# Altium project Off-Line 3W Non Isolated Power Supply.PrjPcb
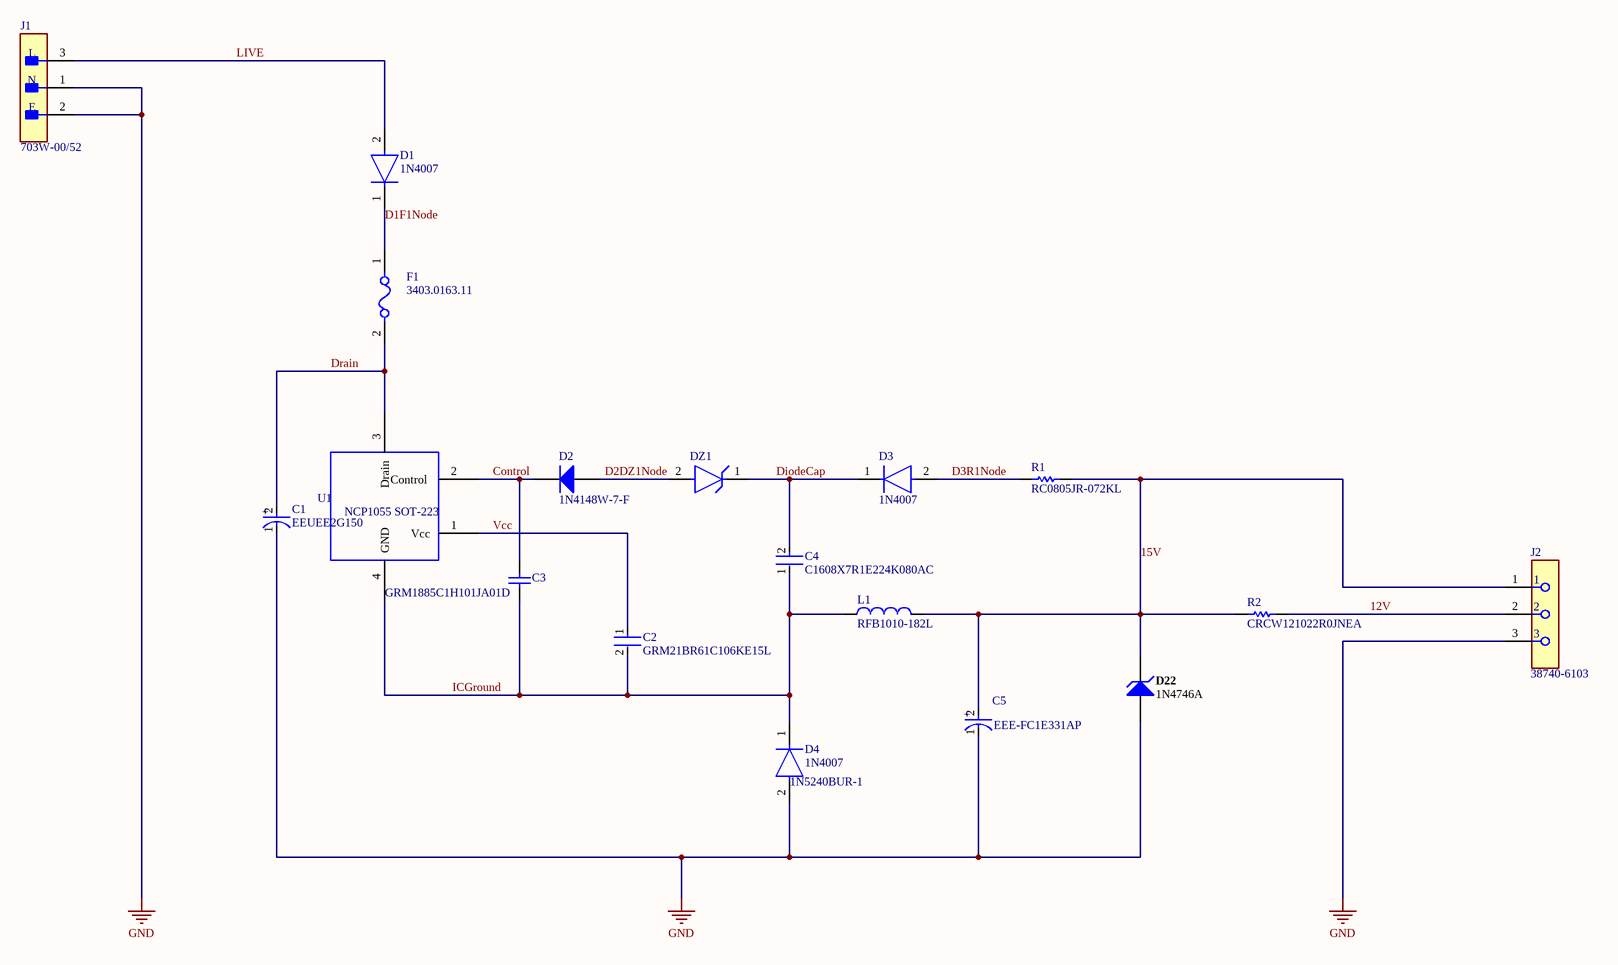
[diagram p0: Off-Line 3W Non Isolated Power Supply.SchDoc]
1 sheet, 18 parts. Net scope: global (net labels, ports and power ports of the same name join across sheets).
Board file: Off-Line 3W Non Isolated Power Supply.PcbDoc

## Sheet Off-Line 3W Non Isolated Power Supply.SchDoc
size A3; SheetNumber: 1; SheetTotal: 1

### Parts
C1  EEUEE2G150  [FP-RAD-TH-D_12_5_0_5-L_20-MFG]
C2  GRM21BR61C106KE15L  [FP-GRM21B-0_1-IPC_C]
C3  GRM1885C1H101JA01D  [CAPC1608X90X35NL10T15]
C4  C1608X7R1E224K080AC  [FP-C1608-080-0_1-IPC_B]
C5  EEE-FC1E331AP  [FP-FC-G-MFG]
D1  1N4007  [FP-1N4007-MFG]
D2  1N4148W-7-F  [DIOD-SOD123-2_V]
D3  1N4007  [FP-1N4007-MFG]
D4  1N4007  [FP-1N4007-MFG]
D22  1N4746A  [FAIR-DO-41-2_V]
DZ1  1N5240BUR-1  [FP-DO-213AA-MFG]
F1  3403.0163.11  [FP-3403_0163_11-MFG]
J1  703W-00/52  [FP-703W-00-52-MFG]
J2  38740-6103  [FP-38740-6103-MFG]
L1  RFB1010-182L  [COIL-RFB1010-2_V]
R1  RC0805JR-072KL  [RESC2013X60X35ML10T20]
R2  CRCW121022R0JNEA  [RESC3225X60X45ML20T20]
U1  NCP1055 SOT-223  [NCP1055 SOT-223]

### Nets
GND: C1.1(C) C5.1(C) D4.2(A) D22.1(A) J1.1(N) J1.2(E) J2.3
12V: J2.2 R2.2
15V: C5.2(A) D22.2(K) J2.1 L1.2 R1.2 R2.1
Control: C3.2 D2.2(K) U1.2(Control)
D1F1Node: D1.1(C) F1.1
D2DZ1Node: D2.1(A) DZ1.2(A)
D3R1Node: D3.2(A) R1.1
DiodeCap: C4.2 D3.1(C) DZ1.1(C)
Drain: C1.2(A) F1.2 U1.3(Drain)
ICGround: C2.2 C3.1 C4.1 D4.1(C) L1.1 U1.4(GND)
LIVE: D1.2(A) J1.3(L)
Vcc: C2.1 U1.1(Vcc)

### Notes on the sheet
- (in symbol CMP-05427-000018-1) +
- (in symbol CMP-05427-000533-1) +

### Library data of the parts
C1 = CMP-05427-000533-1: Aluminum Electrolytic Capacitors (Radial Lead Type) 15uF ±20% 400V; Leakage Current: 370uA; Life (Hours): 10000Hour; Ripple Current: 590mA; Dielectric Material: Aluminium; Polarity: Polar; Lead Diameter: 0.6mm; Dissipation Factor: 0.24%; Construction: RADIAL; Package Quantity: 200; Min Operating Temperature: -25°C; Case/Package: Radial; Voltage: 400V; Tolerance: 20%; Voltage Rating: 400V; Mount: Through Hole; REACH SVHC: No SVHC; Height: 20mm; Capacitance: 15uF; Series: EE; Length: 20mm; Packaging: Bulk; Height - Seated (Max): 0.866inch; Ripple Current (AC): 590mA; Number of Pins: 2; Voltage Rating (DC): 400V; Radiation Hardening: No; Lead Free: Lead Free; Max Operating Temperature: 105°C; RoHS Compliant: Yes; Diameter: 12.5mm; Termination: Radial; Lead Pitch: 5mm
C2 = CMP-2007-03453-2: Chip Multilayer Ceramic Capacitors for General Purpose, 0805, 10uF, X5R, 15%, 10%, 16V; Radiation Hardening: No; Thickness: 0.053inch; Voltage Rating (DC): 16V; Lead Free: Lead Free; Package Quantity: 1; Width: 1.25mm; Case Code (Imperial): 0805; Depth: 1.25mm; Packaging: Tape and Reel; Dielectric: X5R; Max Operating Temperature: 85°C; Tolerance: 10%; Voltage Rating: 16V; Voltage: 16V; Capacitance: 10uF; Height: 1.25mm; Case Code (Metric): 2012; Material: Ceramic; Mount: Surface Mount; Case/Package: 0805; REACH SVHC: No SVHC; Length: 2mm; Min Operating Temperature: -55°C; Termination: SMD/SMT
C3 = CMP-2006-02595-1: Manufacturer: Murata; Part Number: GRM1885C1H101JA01D
C4 = CMP-08246-006302-1: Multilayer Ceramic Capacitors 220nF ±10% 25V X7R SMD 0603; Lead Free: Lead Free; Radiation Hardening: No; Min Operating Temperature: -55°C; RoHS Compliant: Yes; Series: C; Depth: 0.8mm; Capacitance: 220nF; Case/Package: 0603; Max Operating Temperature: 125°C; Dielectric Material: Ceramic; Construction: Flat; REACH SVHC: No SVHC; Packaging: Tape and Reel; Voltage Rating: 25V; Thickness: 0.037inch; Width: 0.031inch; Number of Pins: 2; Package Quantity: 1; Weight: 7.1E-05oz; Mount: Surface Mount; Length: 1.6mm; Case Code (Imperial): 0603; Resistor Type: Ceramic; Voltage Rating (DC): 25V; Height: 0.8mm; Termination: SMD/SMT; Dielectric: X7R; Case Code (Metric): 1608; Tolerance: 10%
C5 = CMP-05427-000018-1: CAP ALUM 330UF 20% 25V SMD; Leakage Current: 3uA; Ripple Current (AC): 670mA; Impedance: 150mR; Life (Hours): 1000Hour; Lead Length: 3.5mm; Dielectric Material: Aluminium; Packaging: Tape and Reel; Diameter: 10mm; Contact Plating: Tin; Voltage Rating: 25V; Voltage Rating (DC): 25V; Width: 10.3mm; Case/Package: Radial; Lead Pitch: 4.6mm; Termination: SMD/SMT; Min Operating Temperature: -40°C; Radiation Hardening: No; Height - Seated (Max): 0.402inch; Mount: Surface Mount; Ripple Current: 670mA; Tolerance: 20%; Max Operating Temperature: 105°C; ESR (Equivalent Series Resistance): 150mR; Number of Pins: 2; Length: 10.5mm; REACH SVHC: No SVHC; Voltage: 25V; Height: 10.2mm; Lead Free: Lead Free; Capacitance: 330uF; Package Quantity: 1
D1 D3 D4 = CMP-123542-000001-1: Rectifier diode 1000 V 1 A DO-41, ,; Manufacturer: Diotec; Max Surge Forward Current: 27A; Forward Current: 1A; Max Junction Temp: +175°C; Reverse Voltage: 1000V; Value: 15pF; Peak Reverse Current: 5uA; Category: Diode; Temperature Range Low: -50°C; Automotive: No; Temperature: -50°C to +175°C; Lead Free: Yes; ComponentLink2Description: Datasheet; Max Repetitive Reverse Voltage: 1000V; ComponentLink2URL: https://datasheet.octopart.com/1N4007-Diotec-datasheet-62346875.pdf; Manufacturer Part Number: 1N4007; Device Class L3: Rectifier Diodes; Height: 2.8mm; Octopart: https://octopart.com/1n4007-diotec-4040411; Package: 1N4007; Temperature Range High: +175°C; Device Class L1: Discrete Semiconductors; Device Class L2: Diodes; RoHS: TRUE; Capacitance: 15pF; Ipc Land Pattern Name: DIOAD888W100L520D280
D2 = CMP-2000-04932-2: Fast Switching Diode, 100 V, 0.15 A, -65 to 150 degC, 2-Pin?SOD123, RoHS, Tape and Reel; Recovery Time: 4ns; Brand: DiodesIncorporated; Unit Weight: 0.000353oz; Max Surge Current: 2A; Peak Reverse Voltage: 100V; Ir - Reverse Current: 1uA; Vf - Forward Voltage: 1.25V; Configuration: Single; If - Forward Current: 0.15A; Product Category: Diodes-GeneralPurpose,Power,Switching; Operating Temperature Range: -65Cto+150C; Packaging: Reel; Manufacturer URL: http://www.diodes.com/; Maximum Operating Temperature: +150C; Height: 1.25mm; Minimum Operating Temperature: -65C; Product: SwitchingDiodes; Package URL: http://www.diodes.com/datasheets/ds18004.pdf; Type: SwitchingDiode; Package Reference: SOD123-2; Width: 1.7mm; Datasheet URL: http://www.farnell.com/datasheets/1915529.pdf; Datasheet Version: Rev. 24-2, 10/2013; Series: 1N4148; Factory Pack Quantity: 3000; Length: 2.85mm; RoHS: True; Manufacturer: DiodesIncorporated; Mounting Style: SMD/SMT; Package / Case: SOD-123
D22 = CMP-0892-00023-1: Zener Diode, 18V, 1W, 5%, -65 to 200 degC, 2-Pin DO-41, Body 2.72 x 5.2 mm, RoHS; Manufacturer: Fairchild Semiconductor; VZ (Max.) (V): 18.9; IR (uA): 5; Test Current IZ (mA): 14; VZ (Min.) (V): 17.1; ZZ (Max) (ohm): 16; PD (W): 1; Operating and Storage Temperature Range: -65 to 200 degC; RoHS: TRUE; ComponentLink1URL: http://www.fairchildsemi.com/; DatasheetVersion: Rev. H3; ComponentLink2Description: Datasheet; ComponentLink3Description: Package Specification; Tolerance: 5%; ComponentLink3URL: http://www.fairchildsemi.com/dwg/DO/DO41A.pdf; PackageVersion: Rev. 2; PartNumber: 1N4746A; ComponentLink2URL: http://www.fairchildsemi.com/ds/1N/1N4744A.pdf; Mounting Technology: Through Hole; PackageDescription: 2-Pin Axial leaded, Body 2.72 x 5.2 mm, Lead Spread 25.4 mm; PackageReference: DO-41-2; ComponentLink1Description: Manufacturer URL
DZ1 = CMP-06360-000046-1: DIODE ZENER
F1 = CMP-26293-000009-1: FUSE BRD MNT 500MA 250VAC 125VDC; Manufacturer: Schurter Inc; Fuse Blow Speed: Slow; Fuse Current: 0.5A; Description: 500mA 250V AC 125V DC Fuse Board Mount (Cartridge Style Excluded) Surface Mount 2-SMD, Square End Block; Max Fuse Ac Voltage: 250V; Fuse I2T: 0.54A2Sec; Fuse Voltage Drop: 600mV; Max Fuse Dc Voltage: 125V; Ambient Temperature Range High: +125°C; Category: Fuse; Lead Free: Yes; Digikey Description: FUSE BRD MNT 500MA 250VAC 125VDC; Height: 3mm; Ambient Temperature Range Low: -55°C; Device Class L1: Circuit Protection; Octopart: https://octopart.com/3403.0163.11-schurter-65395; ComponentLink2URL: https://us.schurter.com/bundles/snceschurter/epim/_ProdPool_/newDS/en/typ_UMT_250.pdf; Device Class L3: unset; Automotive: No; ComponentLink2Description: Datasheet; Device Class L2: Fuses; Package: 0; RoHS: TRUE; Voltage Rating: 125V; Mouser Description: Surface Mount Fuses UMT 250 500mA 277V Slow; Manufacturer Part Number: 3403.0163.11
J1 = CMP-64678-000001-1: PWR ENT RCPT IEC320-C14 PNL SLDR; Max Voltage Rating (AC): 250V; Approvals: UL; Current Rating: 15A; Number of Poles: 2; Fuse: No; Number of Positions: 3; Gender: Receptacle; Panel Thickness: 0.12inch; Pitch: 7mm; Voltage Rating (AC): 250V; Orientation: Right Angle; Contact Plating: Tin; Mount: Through Hole; Housing Material: Thermoplastic; Current: 15A; Termination: Solder; REACH SVHC: No SVHC; Lead Free: Lead Free; Voltage Rating: 250V; Number of Contacts: 3; Color: Black; Connector Type: Receptacle; Packaging: Bulk; Max Current Rating: 15A; Voltage Rating (DC): 250V; Package Quantity: 100
J2 = CMP-00257-08326119-1: 38740-6103 11.11mm Pitch Beau PCB Fixed Mount Barrier Terminal Strip, Low Profile, 300V, 3 Circuits; Manufacturer Lifecycle Status: ACTIVE; Wire Gauge (Min): 24AWG; Number of Circuits: 3; Plating: Tin; Wire Gauge (Max): 10AWG; Current Rating: 15A; Min Operating Temperature: -40°C; Material: Brass; NexarPartId: 8326119; RoHS: Compliant; Country of Origin: US; Color: Black; Number of Poles: 3; Orientation: Horizontal; Termination: Screw; Number of Rows: 1; Length: 54.61mm; Width: 16.002mm; Number of Positions: 3; Number of Contacts: 3; Contact Material: Brass, Tin; Pitch: 11.11mm; Voltage Rating: 300V; Height: 14.478mm; Contact Plating: Tin; Lifecycle Status: Production; Max Operating Temperature: 130°C; ELV: Compliant
L1 = CMP-0899-00024-1: Power Inductor, 1.8 mH +/- 10%, 0.45 A, -40 to 125 degC, 2-Pin Radial Leaded, Dia 11 mm, RoHS, Tray; Manufacturer: Coilcraft; Inductance: 1.8 mH; Irms: 0.55 A @40 degC; DCR: 3.5 Ohm Max.; SRF: 1.3 MHz; Isat: 0.45 A; ComponentLink2Description: Datasheet; Tolerance: 10%; ComponentLink2URL: http://www.coilcraft.com/pdfs/rfb.pdf; DatasheetVersion: Sep-13; PackageReference: RFB1010-2; ComponentLink1URL: http://www.coilcraft.com/; Ambient Temperature Range: -40 to 125 degC; ComponentLink1Description: Manufacturer URL; Mounting Technology: Through Hole; PackageDescription: 2-Pin Radial Leaded, Dia 11 mm, Height 11.5 mm, Radial 6 mm; Packing: Tray; RoHS: TRUE; PartNumber: RFB1010-182L
R1 = CMP-2001-01361-1: Manufacturer: Yageo; Part Number: RC0805JR-072KL
R2 = CMP-2005-02071-1: Manufacturer: Vishay Dale; Part Number: CRCW121022R0JNEA